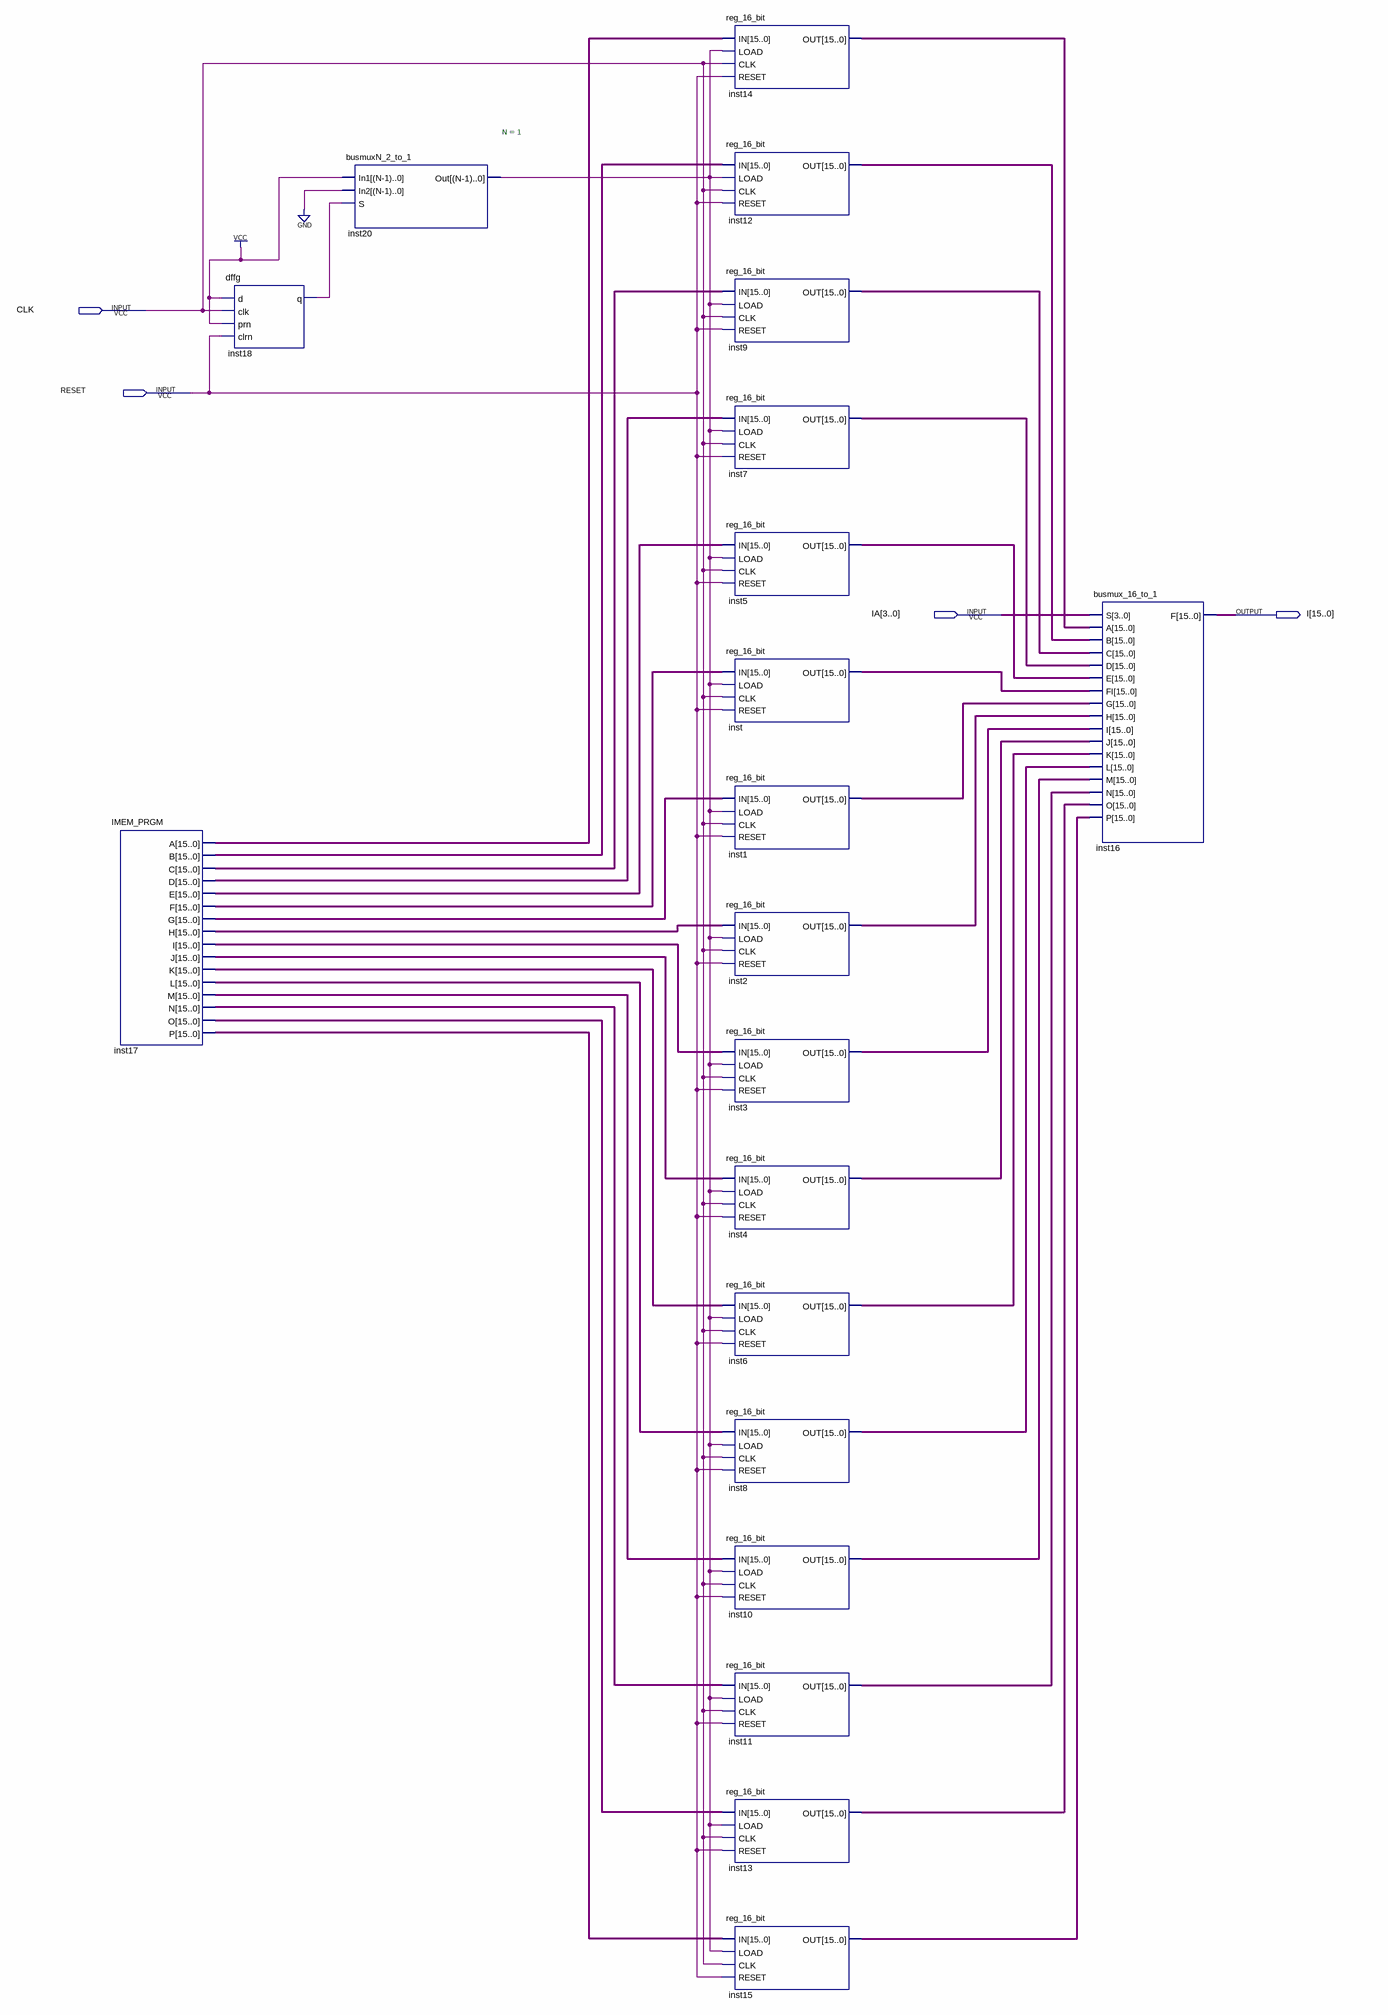
[diagram p0: schematic sheet]
// Quartus schematic IMEM.bdf as structural Verilog: 20 symbols, 4 pins
module IMEM (
  input  CLK,
  input  RESET,
  input  [3:0] IA,
  output [15:0] I
);

  wire inst18_q, inst20_out;
  wire [15:0] inst1_out, inst2_out, inst3_out, inst4_out, inst5_out, inst6_out, inst7_out, inst8_out,
       inst9_out, inst10_out, inst11_out, inst12_out, inst13_out, inst14_out, inst15_out, inst17_a, inst17_b,
       inst17_c, inst17_d, inst17_e, inst17_f, inst17_g, inst17_h, inst17_i, inst17_j, inst17_k, inst17_l,
       inst17_m, inst17_n, inst17_o, inst17_p, inst_out;

  IMEM_PRGM inst17 (
    .A(inst17_a), .B(inst17_b), .C(inst17_c), .D(inst17_d), .E(inst17_e), .F(inst17_f), .G(inst17_g),
    .H(inst17_h), .I(inst17_i), .J(inst17_j), .K(inst17_k), .L(inst17_l), .M(inst17_m), .N(inst17_n),
    .O(inst17_o), .P(inst17_p));
  dffg inst18 (.d(1'b1), .clk(CLK), .prn(1'b1), .clrn(RESET), .q(inst18_q));
  busmuxN_2_to_1 #(.N(1)) inst20 (.In1(1'b1), .In2(1'b0), .S(inst18_q), .Out(inst20_out));
  reg_16_bit inst14 (.IN(inst17_a), .LOAD(inst20_out), .CLK(CLK), .RESET(RESET), .OUT(inst14_out));
  reg_16_bit inst12 (.IN(inst17_b), .LOAD(inst20_out), .CLK(CLK), .RESET(RESET), .OUT(inst12_out));
  reg_16_bit inst9 (.IN(inst17_c), .LOAD(inst20_out), .CLK(CLK), .RESET(RESET), .OUT(inst9_out));
  reg_16_bit inst7 (.IN(inst17_d), .LOAD(inst20_out), .CLK(CLK), .RESET(RESET), .OUT(inst7_out));
  reg_16_bit inst5 (.IN(inst17_e), .LOAD(inst20_out), .CLK(CLK), .RESET(RESET), .OUT(inst5_out));
  reg_16_bit inst (.IN(inst17_f), .LOAD(inst20_out), .CLK(CLK), .RESET(RESET), .OUT(inst_out));
  reg_16_bit inst1 (.IN(inst17_g), .LOAD(inst20_out), .CLK(CLK), .RESET(RESET), .OUT(inst1_out));
  reg_16_bit inst2 (.IN(inst17_h), .LOAD(inst20_out), .CLK(CLK), .RESET(RESET), .OUT(inst2_out));
  reg_16_bit inst3 (.IN(inst17_i), .LOAD(inst20_out), .CLK(CLK), .RESET(RESET), .OUT(inst3_out));
  reg_16_bit inst4 (.IN(inst17_j), .LOAD(inst20_out), .CLK(CLK), .RESET(RESET), .OUT(inst4_out));
  reg_16_bit inst6 (.IN(inst17_k), .LOAD(inst20_out), .CLK(CLK), .RESET(RESET), .OUT(inst6_out));
  reg_16_bit inst8 (.IN(inst17_l), .LOAD(inst20_out), .CLK(CLK), .RESET(RESET), .OUT(inst8_out));
  reg_16_bit inst10 (.IN(inst17_m), .LOAD(inst20_out), .CLK(CLK), .RESET(RESET), .OUT(inst10_out));
  reg_16_bit inst11 (.IN(inst17_n), .LOAD(inst20_out), .CLK(CLK), .RESET(RESET), .OUT(inst11_out));
  reg_16_bit inst13 (.IN(inst17_o), .LOAD(inst20_out), .CLK(CLK), .RESET(RESET), .OUT(inst13_out));
  reg_16_bit inst15 (.IN(inst17_p), .LOAD(inst20_out), .CLK(CLK), .RESET(RESET), .OUT(inst15_out));
  busmux_16_to_1 inst16 (
    .S(IA), .A(inst14_out), .B(inst12_out), .C(inst9_out), .D(inst7_out), .E(inst5_out), .FI(inst_out),
    .G(inst1_out), .H(inst2_out), .I(inst3_out), .J(inst4_out), .K(inst6_out), .L(inst8_out), .M(inst10_out),
    .N(inst11_out), .O(inst13_out), .P(inst15_out), .F(I));
endmodule
